# Altium schematic sheet H_TOP.SchDoc
size A3
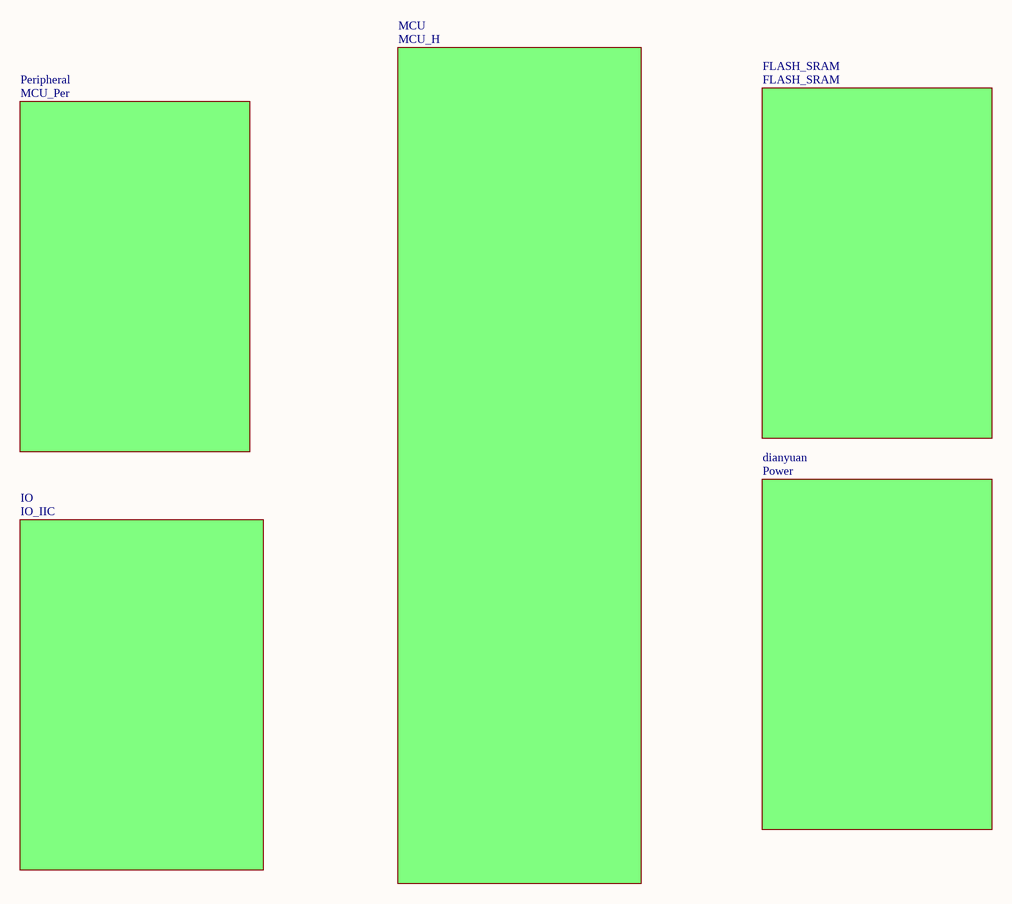
[diagram p0: H_TOP.SchDoc]

## Sub-sheets
dianyuan = Power: no entries
FLASH_SRAM = FLASH_SRAM: no entries
IO = IO_IIC: no entries
MCU = MCU_H: no entries
Peripheral = MCU_Per: no entries